# EasyEDA Pro project ESP32C3电流表.epro

# Schematic Schematic1
Create Date: 2024-03-27; Page Name: P1; Project Name: ESP32C3电流表; Schematic Name: Schematic1; Update Date: 2024-03-28; Company: 嘉立创EDA; Page Size: A4; Version: V1.0
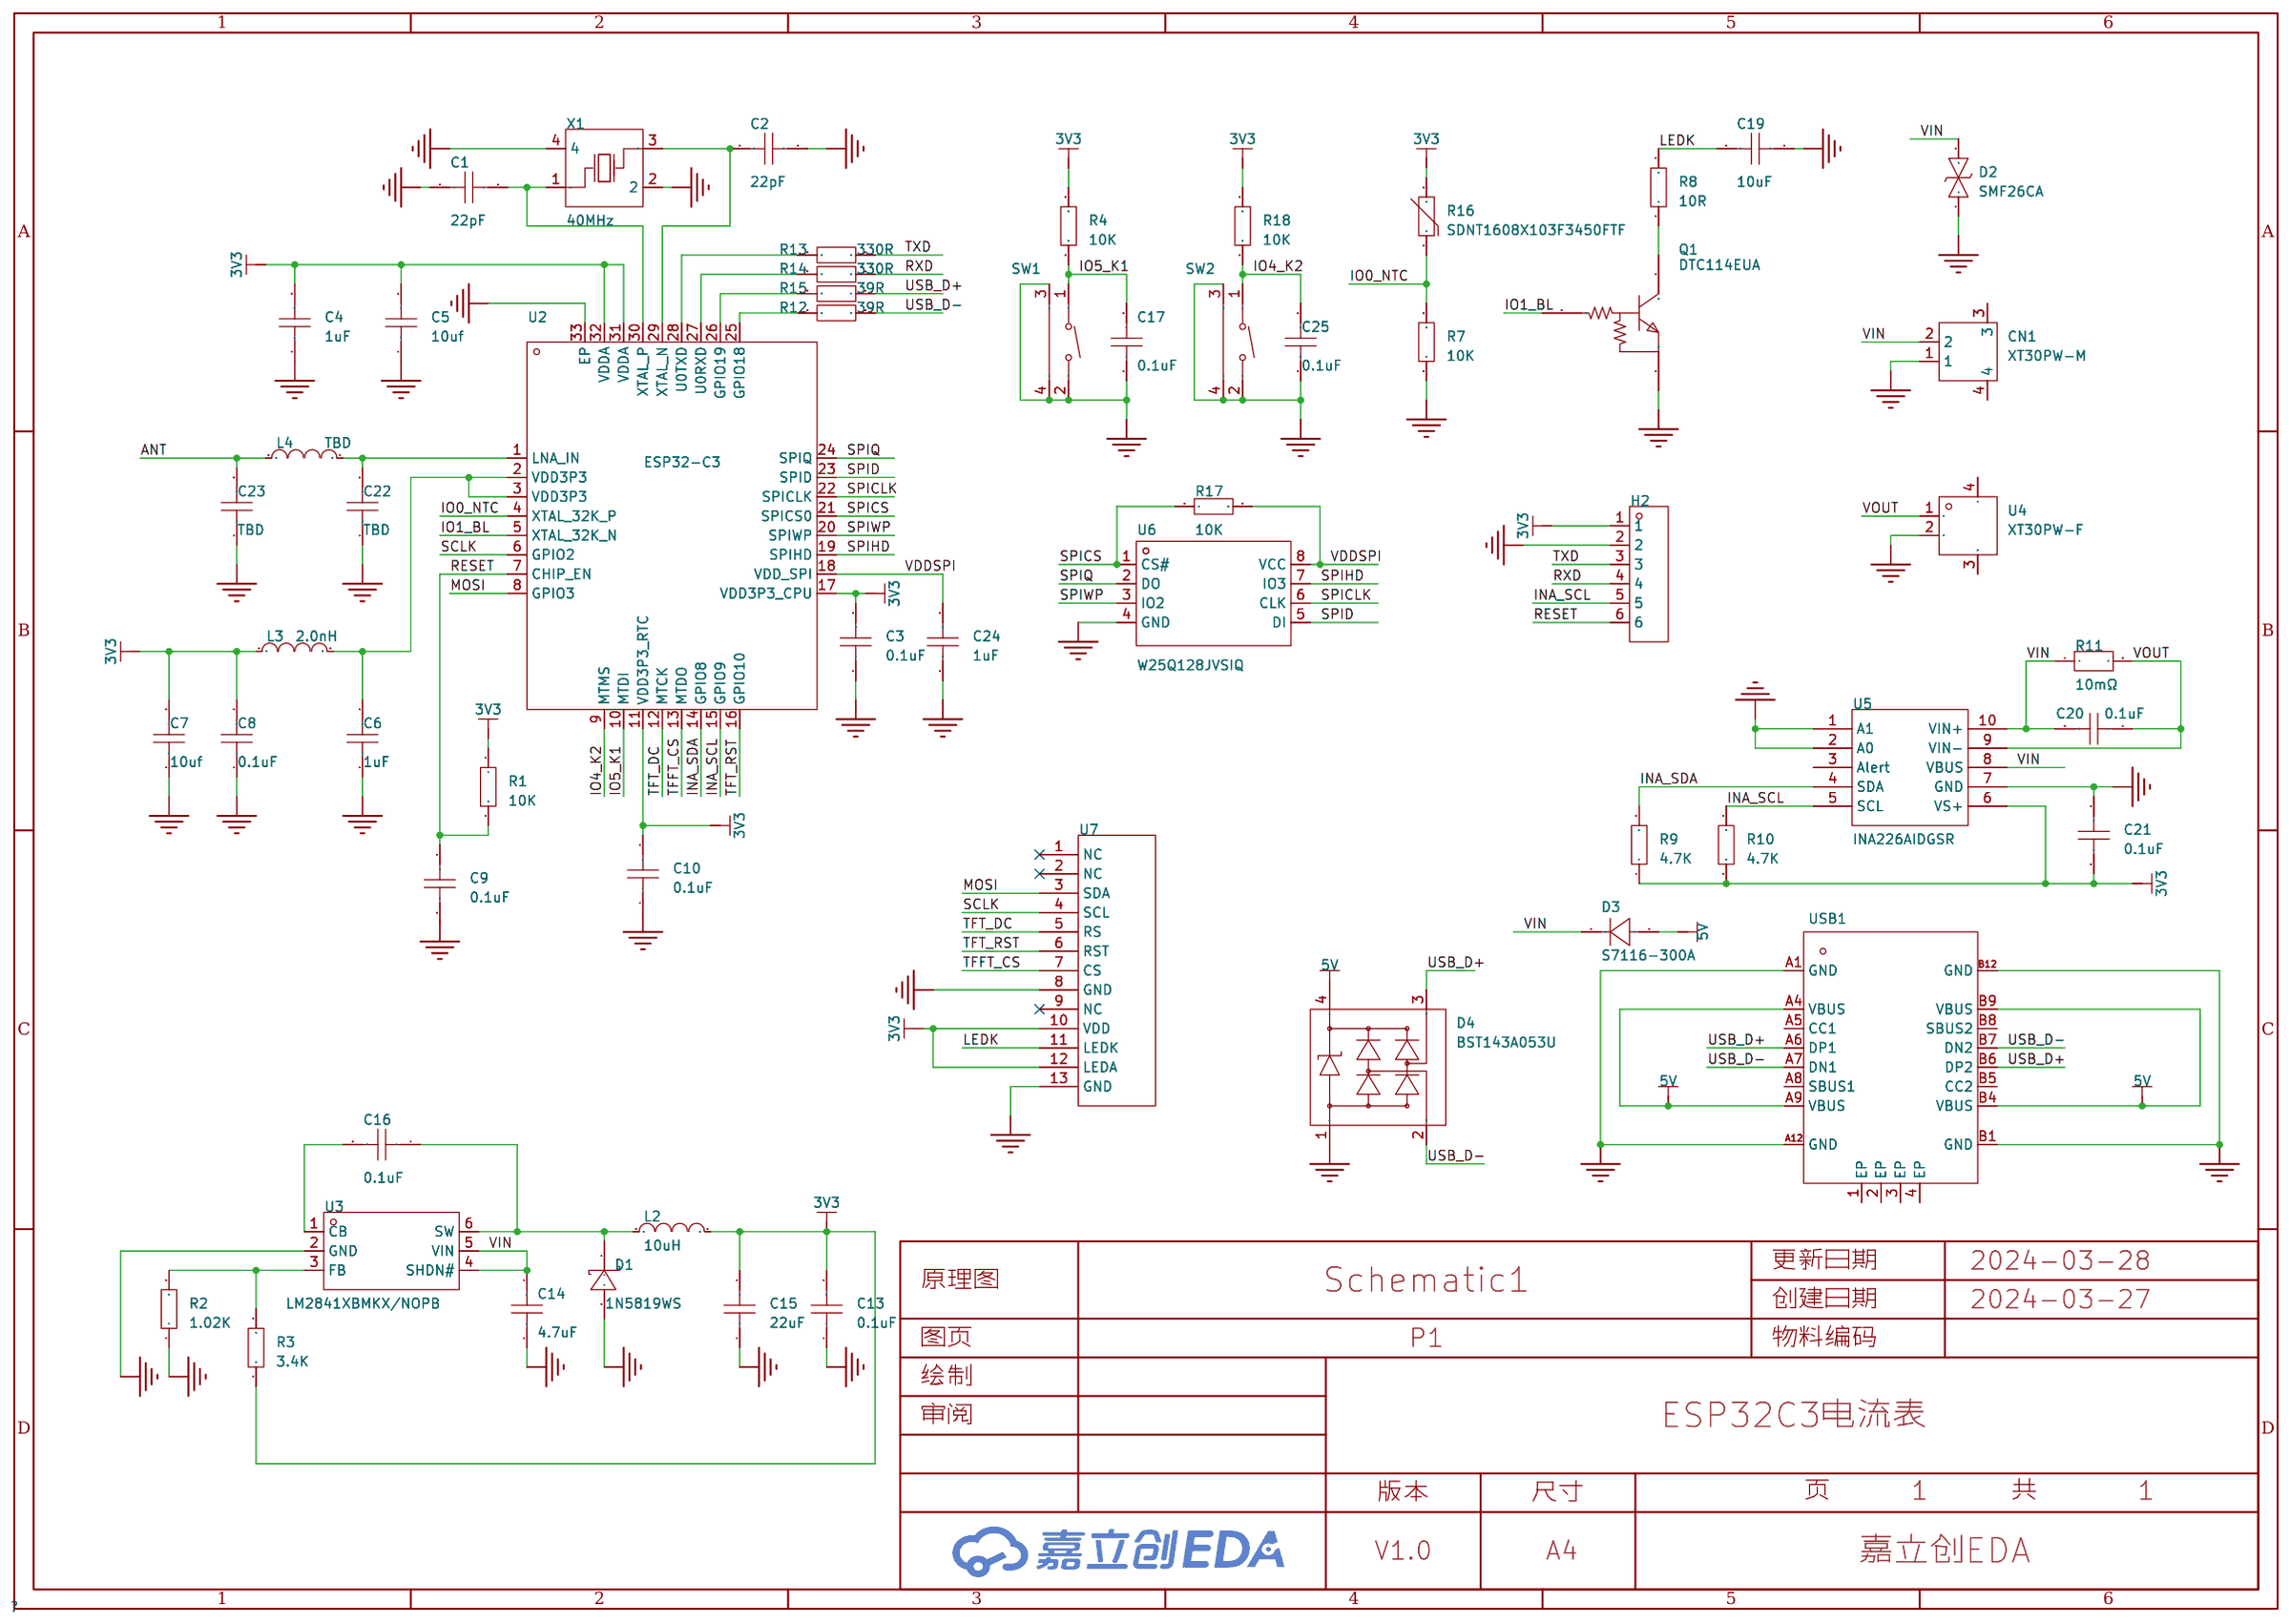
[diagram p0: schematic sheet]

## Parts
C1  22pF  [C0603]
C2  22pF  [C0603]
C3  0.1uF  [C0603]
C4  1uF  [C0603]
C5  10uf  [C0603]
C6  1uF  [C0603]
C7  10uf  [C0603]
C8  0.1uF  [C0603]
C9  0.1uF  [C0603]
C10  0.1uF  [C0603]
C13  0.1uF  [C0603]
C14  4.7uF  [C0805]
C15  22uF  [C0805]
C16  0.1uF  [C0603]
C17  0.1uF  [C0603]
C19  10uF  [C0603]
C20  0.1uF  [C0603]
C21  0.1uF  [C0603]
C22  TBD  [C0603]
C23  TBD  [C0603]
C24  1uF  [C0603]
C25  0.1uF  [C0603]
CN1  XT30PW-M  [CONN-TH_XT30PW-M]
D1  1N5819WS  [SOD-323_L1.8-W1.3-LS2.5-RD]
D2  SMF26CA  [SOD-123_L2.8-W1.8-LS3.7-BI]
D3  S7116-300A  [SOD-323_L1.7-W1.3-LS2.5-RD]
D4  BST143A053U  [SOT-143_L2.9-W1.3-P1.92-LS2.3-BR]
H2  -  [HDR-TH_6P-P2.54-V-F]
L2  10uH  [IND-SMD_L2.5-W2.0_FHD252012S-6R8MT]
L3  2.0nH  [L0603]
L4  TBD  [L0603]
Q1  DTC114EUA  [SOT-323-3_L2.0-W1.3-P1.30-LS2.1-BR]
R1  10K  [R0603]
R2  1.02K  [R0603]
R3  3.4K  [R0603]
R4  10K  [R0603]
R7  10K  [R0603]
R8  10R  [R0603]
R9  4.7K  [R0603]
R10  4.7K  [R0603]
R11  10mΩ  [R2512]
R12  39R  [R0603]
R13  330R  [R0603]
R14  330R  [R0603]
R15  39R  [R0603]
R16  SDNT1608X103F3450FTF  [R0603]
R17  10K  [R0603]
R18  10K  [R0603]
SW1  TS-1010-C-A  [KEY-SMD_TX-1010-X-X]
SW2  TS-1010-C-A  [KEY-SMD_TX-1010-X-X]
U2  ESP32-C3  [QFN-32_L5.0-W5.0-P0.50-TL-EP3.7]
U3  LM2841XBMKX/NOPB  [SOT-23-6_L2.9-W1.6-P0.95-LS2.8-BR]
U4  XT30PW-F  [CONN-TH_XT30PW-F-1]
U5  INA226AIDGSR  [MSOP-10_L3.0-W3.0-P0.50-LS5.0-BL]
U6  W25Q128JVSIQ  [SOIC-8_L5.3-W5.3-P1.27-LS8.0-BL]
U7  -  [ST7789]
USB1  -  [USB_TYPE-C-16P]
X1  40MHz  [OSC-SMD_4P-L3.2-W2.5-BL]

## Library data of the parts
C1-C10 C13 C16 C17 C19-C25 = CAP_0603: Supplier Footprint: 0603
C14 C15 = CAP_0805: Supplier Footprint: 0805
CN1 = XT30PW-M: 类别:-;类型1:-;; LCSC Part Name: AMASS(艾迈斯)航模插头 卧式弯脚 XT30PW-M公头; Supplier Part: C431092; Manufacturer: AMASS(艾迈斯); JLCPCB Part Class: 扩展库; Datasheet: https://atta.szlcsc.com/upload/public/pdf/source/20220222/6A9F22F7850E25B33E1BE430ADF8560B.pdf; Supplier: LCSC; Brand: 艾迈斯; Type: 航模插头; RatedVoltage: DC 500V; InterfaceType: 公头; RatedCurrent: 15A; RecommendedWireGauge: 16/18/20AWG; contact resistance: 1.2mΩ; specifications: 2pin
D1 = 1N5819WS_C191023: 正向压降(Vf):600mV@1A;直流反向耐压(Vr):40V;平均整流电流(Io):1A;; LCSC Part Name: 电压:40V 电流:1A; Supplier Part: C191023; Manufacturer: Hottech(合科泰); Supplier Footprint: SOD-323; JLCPCB Part Class: 基础库; Datasheet: https://atta.szlcsc.com/upload/public/pdf/source/20220428/3CB86FD8D28D653594B4E35F9D5AEFD9.pdf; Supplier: LCSC; Forward Voltage (Vf@If): 600mV@1A; Reverse Voltage (Vr): 40V; Average Rectified Current (Io): 1A
D2 = SMF26CA_C435495: 反向截止电压(Vrwm):26V;最大钳位电压:42.1V;峰值脉冲电流(Ipp)@10/1000us:4.8A;击穿电压:28.9V;; Supplier Part: C435495; Manufacturer: AnBon(安邦); Supplier Footprint: SOD-123; JLCPCB Part Class: 扩展库; Datasheet: https://atta.szlcsc.com/upload/public/pdf/source/20191009/C435508_DB7B75E48DB0811659B52C5D7F67F4F0.pdf; Supplier: LCSC; Reverse Stand-Off Voltage (Vrwm): 26V; Maximum Clamping Voltage: 42.1V; Peak Pulse Current (Ipp)@10/1000us: 4.8A; Breakdown Voltage: 28.9V; Type: TVS
D3 = S7116-300A: 二极管配置:独立式;正向压降(Vf):500mV@1A;直流反向耐压(Vr):45V;平均整流电流(Io):1A;; Supplier Part: C5174649; Manufacturer: MSKSEMI(美森科); Supplier Footprint: SOD-323; JLCPCB Part Class: 扩展库; Datasheet: https://atta.szlcsc.com/upload/public/pdf/source/20220916/6E626650AF012B3914EB9177AF15DFBA.pdf; Supplier: LCSC; Diode Configuration: 独立式; Forward Voltage (Vf@If): 500mV@1A; Reverse Voltage (Vr): 45V; Average Rectified Current (Io): 1A
D4 = BST143A053U: 反向截止电压(Vrwm):5V;最大钳位电压:25V;峰值脉冲电流(Ipp)@10/1000us:12A@8/20us;; Supplier Part: C151979; Manufacturer: BORN(伯恩半导体); Supplier Footprint: SOT-143; JLCPCB Part Class: 扩展库; Datasheet: https://atta.szlcsc.com/upload/public/pdf/source/20180207/C151979_15179948915521359098.pdf; Supplier: LCSC; Reverse Stand-Off Voltage (Vrwm): 5V; Maximum Clamping Voltage: 25V; Peak Pulse Current (Ipp)@10/1000us: 12A@8/20us; Type: TVS
H2 = HDR-F_2.54_1x6P: Supplier Part: C40877; Supplier Footprint: 插件
L2 = FHD252012S-100MT: 电感值:10uH;精度:±20%;额定电流:1A;饱和电流(Isat):1.35A;; LCSC Part Name: 10uH ±20% 1.35A; Supplier Part: C602018; Manufacturer: cjiang(长江微电); Supplier Footprint: 1008; JLCPCB Part Class: 扩展库; Datasheet: https://atta.szlcsc.com/upload/public/pdf/source/20200609/C601990_BCEA243EC4DA0A9A288AA78A6DFB48A5.pdf; Supplier: LCSC; Tolerance: ±20%; Rated Current: 1A; Saturation Current (Isat): 1.35A; DC Resistance (DCR): 435mΩ
L3 L4 = L_0603
Q1 = DTC114EUA_C55054: 晶体管类型:1个NPN-预偏置;集射极击穿电压(Vceo):50V;集电极电流(Ic):50mA;功率(Pd):200mW;; LCSC Part Name: 电流:50mA 耐压:50V; Supplier Part: C55054; Manufacturer: CJ(江苏长电/长晶); Supplier Footprint: SOT-323-3; JLCPCB Part Class: 扩展库; Datasheet: https://atta.szlcsc.com/upload/public/pdf/source/20150811/1457707342575.pdf; Supplier: LCSC; Transistor Type: 1个NPN-预偏置; Collector-Emitter Breakdown Voltage (Vceo): 50V; Collector Current (Ic): 50mA; Power Dissipation (Pd): 200mW
R1-R4 R7-R10 R12-R15 R17 R18 = Res_0603: Supplier Footprint: 0603
R11 = PA2512FKE7T0R01E: 电阻类型:采样电阻;阻值:10mΩ;精度:±1%;额定压降:-;功率:3W;温度系数:±50ppm/℃;安装方式:-;; LCSC Part Name: 10mΩ ±1% 3W; Supplier Part: C375691; Manufacturer: YAGEO(国巨); Supplier Footprint: 2512; JLCPCB Part Class: 扩展库; Datasheet: https://atta.szlcsc.com/upload/public/pdf/source/20190227/C375693_219964CC8B3EBD36DBDF701587FA5938.pdf; Supplier: LCSC; Type: 采样电阻; Tolerance: ±1%; Power(Watts): 3W; Temperature Coefficient: ±50ppm/℃
R16 = SDNT1608X103F3450FTF: 阻值(25℃):10kΩ;B值(25℃/50℃):3450K;电阻精度:±1%;功率:100mW;B值精度:±1%;最大稳态电流(25℃):310uA;; LCSC Part Name: 10kΩ 电阻精度:±1% 3450K; Supplier Part: C95953; Manufacturer: Sunlord(顺络); Supplier Footprint: 0603; JLCPCB Part Class: 扩展库; Datasheet: https://atta.szlcsc.com/upload/public/pdf/source/20210916/BF106A3565EDFEB141CB3E0EA3A661F8.pdf; Supplier: LCSC; Resistance @ 25℃: 10kΩ; B Constant (25℃/50℃): 3450K; Resistance Tolerance: ±1%; Power: 100mW; B Constant Tolerance: ±1%; Steady State Current (Max): 310uA; Operating Temperature: -55℃~+125℃
SW1 SW2 = TS-1010-C-A: 电路结构:单刀单掷;按钮形状:矩形按钮;作用力:260gf;安装方式:卧贴;开关长度:2.3mm;开关宽度:4.7mm;开关高度:3.5mm;带支架:不带;触点电流:50mA;额定电压(AC):-;额定电压(DC):12V;额定功率:-;绝缘电阻:-;带灯:无;机械寿命:10万次;; LCSC Part Name: 2.3*4.7*3.5mm 卧贴 轻触开关; Supplier Part: C692458; Manufacturer: XKB Connectivity(中国星坤); Supplier Footprint: SMD; JLCPCB Part Class: 扩展库; Datasheet: https://atta.szlcsc.com/upload/public/pdf/source/20211011/09621D275CE0F472C941775DFBBCCC96.pdf; Supplier: LCSC; Circuit: 单刀单掷; Actuator Style: 矩形按钮; Operating Force: 260gf; Mounting Style: 卧贴; Switch Length: 2.3mm; Switch Width: 4.7mm; Switch Height: 3.5mm; Strike Gundam: 不带; Contact Current: 50mA; Voltage Rating (DC): 12V; Actuator/Cap Color: 黑色; With Lamp: 无; Mechanical Life: 10万次; Operating Temperature: -30℃~+85℃
U2 = ESP32-C3: CPU内核:RISC-V;RAM总容量:400KB;GPIO端口数量:22;工作电压范围:3V~3.6V;CPU最大主频:160MHz;程序存储器类型:-;; Supplier Part: C2838500; Manufacturer: ESPRESSIF(乐鑫); Supplier Footprint: QFN-32-EP(5x5); JLCPCB Part Class: 扩展库; Datasheet: https://atta.szlcsc.com/upload/public/pdf/source/20231220/86199E4714F7A99F6AA9401EA48CDBDA.pdf; Supplier: LCSC; CPU Core: RISC-V; RAM Size: 400KB; GPIO Ports Number: 22; Operating Voltage Range: 3V~3.6V; CPU Maximum Speed: 160MHz; Operating Temperature Range: -40℃~+105℃; ADC (Bit): 12bit; UART/USART: 2; I2C: 1; I2S: 1; SPI: 3; Peripheral/Function: 蓝牙协议栈；片载温度传感器；真随机数发生器；DMA；看门狗；WIFI协议栈；硬件密码算法引擎；54位Timer；PWM；RTC实时时钟; communication protocol: 蓝牙协议；WIFI协议; Watchdog: 有; Real-Time Clock: 有; Direct Memory Access: 有
U3 = LM2841XBMKX/NOPB: 功能类型:降压型;输入电压:-;输出电流(最大值):-;; Supplier Part: C19347; Manufacturer: TI(德州仪器); Supplier Footprint: SOT-23-6; JLCPCB Part Class: 扩展库; Datasheet: http://www.ti.com/; Supplier: LCSC; Function: 降压型; Switch tube (built-in/external): 内置
U4 = XT30PW-F: 类别:-;类型1:-;; LCSC Part Name: AMASS(艾迈斯)电源连接器 母头 XT30PW-F; Supplier Part: C2913282; Manufacturer: AMASS(艾迈斯); JLCPCB Part Class: 扩展库; Datasheet: https://atta.szlcsc.com/upload/public/pdf/source/20231218/06CFCF98887A9A87638B0856A725C8FD.pdf; Supplier: LCSC; Brand: 艾迈斯; Type: 航模插头; InterfaceType: 母头
U5 = INA226AIDGSR: INA226 支持报警功能的 36V、双向、超高精度、低侧/高侧、I2C 输出电流/功率监控器; Supplier Part: C49851; Manufacturer: TI(德州仪器); Supplier Footprint: MSOP-10; JLCPCB Part Class: 扩展库; Datasheet: https://www.ti.com/cn/lit/gpn/ina226; Supplier: LCSC; Supply Voltage: 0V~36V; Operating Temperature: -40℃~+125℃
U6 = W25Q128JVSIQ: 接口类型:-;存储容量:128Mbit;时钟频率(fc):-;; LCSC Part Name: W25Q128JVSIQ 编带; Supplier Part: C97521; Manufacturer: WINBOND(华邦); Supplier Footprint: SOIC-8-208mil; JLCPCB Part Class: 基础库; Datasheet: https://atta.szlcsc.com/upload/public/pdf/source/20170316/1489627409956.pdf; Supplier: LCSC; Memory Size: 128Mbit
U7 = ST7789
USB1 = USB_TYPE-C-16P: Supplier Footprint: SMD
X1 = 1ZNY12000AB0C: 晶振类型:-;频率:-;外接负载电容:-;; LCSC Part Name: 12MHz 12pF; Supplier Part: C253730; Manufacturer: KDS(大真空); Supplier Footprint: SMD3225-4P; JLCPCB Part Class: 扩展库; Datasheet: https://atta.szlcsc.com/upload/public/pdf/source/20240109/50CD19B77F5B596E0573B9A206470299.pdf; Supplier: LCSC

## Nets
3V3: C3.2 C4.2 C5.2 C7.2 C8.2 C10.2 C13.2 C15.2 C21.2 H2.1 L2.2 L3.1 R1.1 R3.1 R4.2 R9.1 R10.1 R16.2 R18.2 U2.11(VDD3P3_RTC) U2.17(VDD3P3_CPU) U2.31(VDDA) U2.32(VDDA) U5.6(VS+) U7.10(VDD) U7.12(LEDA)
5V: D3.2(A) D4.4 USB1.A4(VBUS) USB1.A9(VBUS) USB1.B4(VBUS) USB1.B9(VBUS)
GND: C1.1 C2.2 C3.1 C4.1 C5.1 C6.1 C7.1 C8.1 C9.2 C10.1 C13.1 C14.1 C15.1 C17.1 C19.1 C21.1 C22.1 C23.1 C24.1 C25.1 CN1.1 D1.2(A) D2.1 D4.1 H2.2 Q1.2(GND) R2.1 R7.1 SW1.2 SW1.3 SW1.4 SW2.2 SW2.3 SW2.4 U2.33(EP) U3.2(GND) U4.2 U5.1(A1) U5.2(A0) U5.7(GND) U6.4(GND) U7.8(GND) U7.13(GND) USB1.A1(GND) USB1.A12(GND) USB1.B1(GND) USB1.B12(GND) X1.2 X1.4
VDDSPI: C24.2 R17.2 U2.18(VDD_SPI) U6.8(VCC)
VIN: C14.2 C20.2 CN1.2 D2.2 D3.1(K) R11.1 U3.4(SHDN#) U3.5(VIN) U5.8(VBUS) U5.10(VIN+)
ANT: C23.2 L4.1
INA_SCL: H2.5 R10.2 U2.15(GPIO9) U5.5(SCL)
INA_SDA: R9.2 U2.14(GPIO8) U5.4(SDA)
IO0_NTC: R7.2 R16.1 U2.4(XTAL_32K_P)
IO1_BL: Q1.1(IN) U2.5(XTAL_32K_N)
IO4_K2: C25.2 R18.1 SW2.1 U2.9(MTMS)
IO5_K1: C17.2 R4.1 SW1.1 U2.10(MTDI)
LEDK: C19.2 R8.2 U7.11(LEDK)
MOSI: U2.8(GPIO3) U7.3(SDA)
RESET: C9.1 H2.6 R1.2 U2.7(CHIP_EN)
RXD: H2.4 R14.1
SCLK: U2.6(GPIO2) U7.4(SCL)
SPICLK: U2.22(SPICLK) U6.6(CLK)
SPICS: R17.1 U2.21(SPICS0) U6.1(CS#)
SPID: U2.23(SPID) U6.5(DI)
SPIHD: U2.19(SPIHD) U6.7(IO3)
SPIQ: U2.24(SPIQ) U6.2(DO)
SPIWP: U2.20(SPIWP) U6.3(IO2)
TFFT_CS: U2.13(MTDO) U7.7(CS)
TFT_DC: U2.12(MTCK) U7.5(RS)
TFT_RST: U2.16(GPIO10) U7.6(RST)
TXD: H2.3 R13.1
USB_D+: D4.3 R15.1 USB1.A6(DP1) USB1.B6(DP2)
USB_D-: D4.2 R12.1 USB1.A7(DN1) USB1.B7(DN2)
VOUT: C20.1 R11.2 U4.1 U5.9(VIN-)
$1N2271: R12.2 U2.25(GPIO18)
$1N2275: R15.2 U2.26(GPIO19)
$1N2279: R14.2 U2.27(U0RXD)
$1N2283: R13.2 U2.28(U0TXD)
$1N2291: C2.1 U2.29(XTAL_N) X1.3(OSC2)
$1N2297: C1.2 U2.30(XTAL_P) X1.1(OSC1)
$1N3406: C16.2 U3.1(CB)
$1N3430: R2.2 R3.2 U3.3(FB)
$1N3499: C16.1 D1.1(K) L2.1 U3.6(SW)
$1N4049: Q1.3(OUT) R8.1
$1N6152: C22.2 L4.2 U2.1(LNA_IN)
$1N9079: C6.2 L3.2 U2.2(VDD3P3) U2.3(VDD3P3)

Not connected (* = marked no-connect by the designer): CN1 3 4; U4 3 4; U5 3(Alert); U7 1(NC)* 2(NC)* 9(NC)*; USB1 1(EP) 2(EP) 3(EP) 4(EP) A5(CC1) A8(SBUS1) B5(CC2) B8(SBUS2)

# Board PCB1
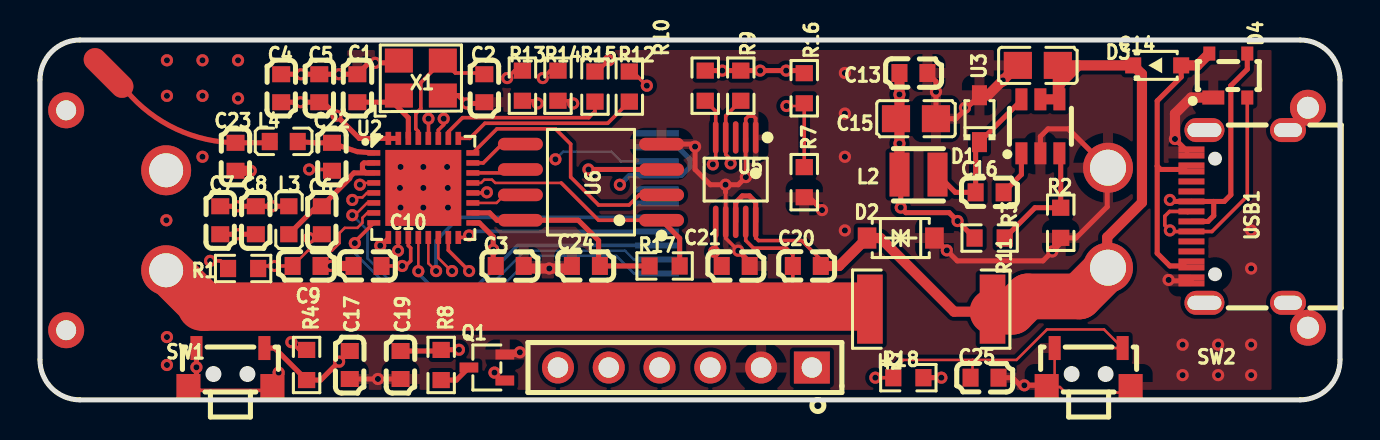
[diagram p1: board, top side]
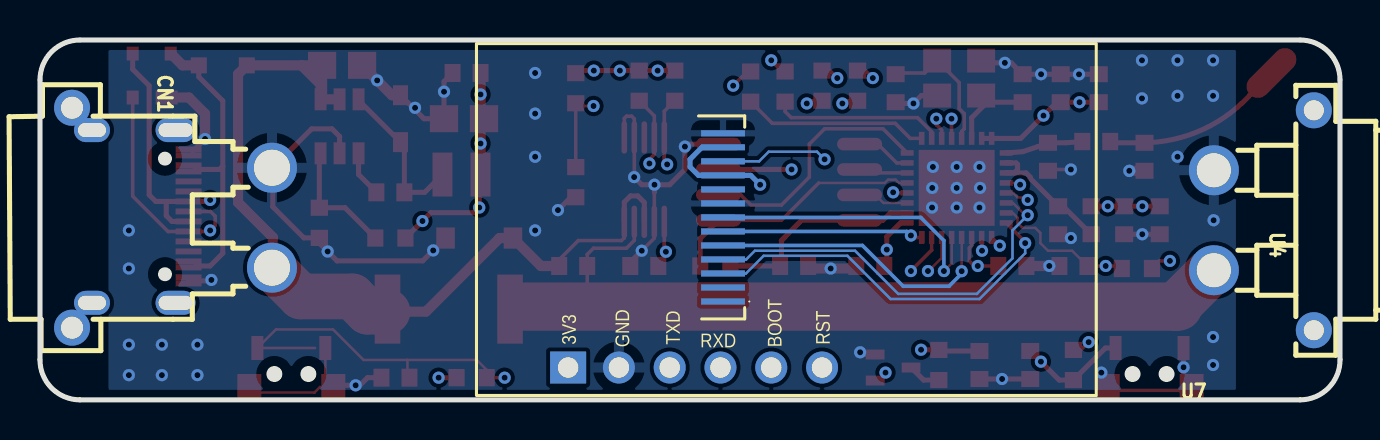
[diagram p2: board, bottom side, seen from below]

Outline 65.02 x 18 mm; copper layers: Top Layer, GND, VCC, Bottom Layer. Coordinates in mm from the lower left corner of the outline.
Outline path: 0,16 0,2 arc(0.59,0.59) 2,0 63.02,0 arc(64.44,0.59) 65.02,2 65.02,16 arc(64.44,17.41) 63.02,18 2,18 arc(0.59,17.41) 0,16
Stack: Top Layer 0.035mm 外层铜厚1oz / Dielectric1 0.2104mm 7628 RC49% 8.6mil / GND 0.0152mm 内层铜厚 / Dielectric2 1.065mm 1.1mm H/HOZ 含铜 / VCC 0.0152mm 内层铜厚 / Dielectric3 0.2104mm 7628 RC49% 8.6mil / Bottom Layer 0.035mm 外层铜厚1oz

## Design rules (mm)
template: 自定义配置
spacing copperThickness1oz (default): track to track 0.102, other pairs 0.152 to 0.3
spacing copperThickness2oz: track to track 0.203, other pairs 0.152 to 0.3
track width copperThickness1oz (default): min 0.127, default 0.254, max 2.54
track width copperThickness2oz: min 0.203, default 0.254, max 2.54
differential pair differentialPair (default): width min 0.127, default 0.254, max 2.54; gap min 0.152, default 0.152
via viaSize (default): diameter min 0.5, default 0.61, max 10; hole min 0.3, default 0.305, max 6.299

## Placement (name value [footprint] x y rotation side)
C1  22pF  [C0603]  15.88 15.59 270 top
C2  22pF  [C0603]  22.22 15.59 270 top
C3  0.1uF  [C0603]  23.5 6.7 180 top
C4  1uF  [C0603]  12.06 15.59 270 top
C5  10uf  [C0603]  13.97 15.59 270 top
C6  1uF  [C0603]  14.1 8.98 90 top
C7  10uf  [C0603]  9.02 8.98 90 top
C8  0.1uF  [C0603]  10.79 8.98 90 top
C9  0.1uF  [C0603]  13.34 6.7 0 top
C10  0.1uF  [C0603]  16.38 6.7 0 top
C13  0.1uF  [C0603]  43.69 16.35 180 top
C14  4.7uF  [C0805]  49.91 16.73 0 top
C15  22uF  [C0805]  43.81 14.06 180 top
C16  0.1uF  [C0603]  47.5 10.38 0 top
C17  0.1uF  [C0603]  15.49 1.74 90 top
C19  10uF  [C0603]  18.03 1.74 90 top
C20  0.1uF  [C0603]  38.35 6.7 0 top
C21  0.1uF  [C0603]  34.8 6.7 180 top
C22  TBD  [C0603]  14.6 12.16 90 top
C23  TBD  [C0603]  9.78 12.16 90 top
C24  1uF  [C0603]  27.31 6.7 0 top
C25  0.1uF  [C0603]  47.24 1.11 180 top
CN1  XT30PW-M  [CONN-TH_XT30PW-M]  58.42 9.11 270 bottom
D1  1N5819WS  [SOD-323_L1.8-W1.3-LS2.5-RD]  46.99 14.06 90 top
D2  SMF26CA  [SOD-123_L2.8-W1.8-LS3.7-BI]  43.05 8.09 0 top
D3  S7116-300A  [SOD-323_L1.7-W1.3-LS2.5-RD]  55.88 16.73 0 top
D4  BST143A053U  [SOT-143_L2.9-W1.3-P1.92-LS2.3-BR]  59.44 16.22 270 top
H2  -  [HDR-TH_6P-P2.54-V-F]  32.26 1.62 180 top
L2  10uH  [IND-SMD_L2.5-W2.0_FHD252012S-6R8MT]  43.94 11.27 180 top
L3  2.0nH  [L0603]  12.45 8.98 270 top
L4  TBD  [L0603]  12.19 12.92 0 top
NOREF  -  [Pad_e656]  3.43 16.35 135 top
Q1  DTC114EUA  [SOT-323-3_L2.0-W1.3-P1.30-LS2.1-BR]  22.35 1.62 0 top
R1  10K  [R0603]  10.16 6.57 0 top
R2  1.02K  [R0603]  51.05 8.86 90 top
R3  3.4K  [R0603]  47.5 8.09 0 top
R4  10K  [R0603]  13.34 1.74 90 top
R7  10K  [R0603]  38.23 10.89 90 top
R8  10R  [R0603]  20.07 1.74 90 top
R9  4.7K  [R0603]  35.05 15.71 270 top
R10  4.7K  [R0603]  33.27 15.71 270 top
R11  10mΩ  [R2512]  44.58 4.54 180 top
R12  39R  [R0603]  29.48 15.67 270 top
R13  330R  [R0603]  24.13 15.71 90 top
R14  330R  [R0603]  25.91 15.71 90 top
R15  39R  [R0603]  27.76 15.67 270 top
R16  SDNT1608X103F3450FTF  [R0603]  38.23 15.59 90 top
R17  10K  [R0603]  31.24 6.7 180 top
R18  10K  [R0603]  43.43 1.11 0 top
SW1  TS-1010-C-A  [KEY-SMD_TX-1010-X-X]  9.53 1.62 180 top
SW2  TS-1010-C-A  [KEY-SMD_TX-1010-X-X]  52.45 1.62 180 top
U2  ESP32-C3  [QFN-32_L5.0-W5.0-P0.50-TL-EP3.7]  19.17 10.6 0 top
U3  LM2841XBMKX/NOPB  [SOT-23-6_L2.9-W1.6-P0.95-LS2.8-BR]  50.04 13.68 270 top
U4  XT30PW-F  [CONN-TH_XT30PW-F-1]  3.81 8.98 90 bottom
U5  INA226AIDGSR  [MSOP-10_L3.0-W3.0-P0.50-LS5.0-BL]  34.8 11.02 180 top
U6  W25Q128JVSIQ  [SOIC-8_L5.3-W5.3-P1.27-LS8.0-BL]  27.56 10.89 90 top
U7  -  [ST7789]  30.86 4.92 0 bottom
USB1  HC-TYPE-C-16P-01B  [USB_TYPE-C-16P]  60.01 9.05 90 top
X1  40MHz  [OSC-SMD_4P-L3.2-W2.5-BL]  19.05 16.09 0 top

## Footprints (pads in the part's own frame, mm; a bottom-side part is the same pattern mirrored in y, then rotated)
C0603
  rect 0.8x0.9 smd: 1(-0.7,0) 2(0.7,0)
C0805
  rect 1.41x1.35 smd: 1(-1,0) 2(1,0)
CONN-TH_XT30PW-F-1
  round 2.5 hole 1.7: 1(-2.5,2.5) 2(2.5,2.5)
  round 1.8 hole 1: 3(5.5,-2.5) 4(-5.5,-2.5)
CONN-TH_XT30PW-M
  round 2.5 hole 1.8: 1(-2.5,5) 2(2.5,5)
  round 1.8 hole 1.1: 3(5.5,-5) 4(-5.5,-5)
HDR-TH_6P-P2.54-V-F
  rect 1.8x1.6 hole 1.02: 1(-6.35,0)
  round 1.6 hole 1.02: 2(-3.81,0) 3(-1.27,0) 4(1.27,0) 5(3.81,0) 6(6.35,0)
IND-SMD_L2.5-W2.0_FHD252012S-6R8MT
  rect 1x2.2 smd: 1(-0.951,0) 2(0.951,0)
KEY-SMD_TX-1010-X-X
  rect 0.6x1.2 smd: 1(-1.7,-0.975) 2(1.7,-0.975)
  rect 1.2x1.3 smd: 3(-2.1,0.975) 4(2.1,0.975)
L0603
  rect 0.8x0.864 smd: 1(-0.7,0) 2(0.7,0)
MSOP-10_L3.0-W3.0-P0.50-LS5.0-BL
  oval 0.28x1.62 smd: 1(-1,-2.11) 2(-0.5,-2.11) 3(0,-2.11) 4(0.5,-2.11) 5(1,-2.11) 6(1,2.11) 7(0.5,2.11) 8(0,2.11) 9(-0.5,2.11) 10(-1,2.11)
OSC-SMD_4P-L3.2-W2.5-BL
  rect 1.4x1.2 smd: 1(-1.1,-0.875) 2(1.1,-0.875) 3(1.1,0.875) 4(-1.1,0.875)
Pad_e656
  oval 3.048x1.143 smd: 1(0,0)
QFN-32_L5.0-W5.0-P0.50-TL-EP3.7
  rect 0.65x0.28 smd: 1(-2.478,1.75) 2(-2.478,1.25) 3(-2.478,0.75) 4(-2.478,0.25) 5(-2.478,-0.25) 6(-2.478,-0.75) 7(-2.478,-1.25) 8(-2.478,-1.75) 17(2.478,-1.75) 18(2.478,-1.25) 19(2.478,-0.75) 20(2.478,-0.25) 21(2.478,0.25) 22(2.478,0.75) 23(2.478,1.25) 24(2.478,1.75)
  rect 0.28x0.65 smd: 9(-1.75,-2.478) 10(-1.25,-2.478) 11(-0.75,-2.478) 12(-0.25,-2.478) 13(0.25,-2.478) 14(0.75,-2.478) 15(1.25,-2.478) 16(1.75,-2.478) 25(1.75,2.478) 26(1.25,2.478) 27(0.75,2.478) 28(0.25,2.478) 29(-0.25,2.478) 30(-0.75,2.478) 31(-1.25,2.478) 32(-1.75,2.478)
  rect 3.8x3.8 smd: 33(0,0)
R0603
  rect 0.806x0.864 smd: 1(-0.753,0) 2(0.753,0)
R2512
  rect 1.282x3.456 smd: 1(-3.067,0) 2(3.067,0)
SOD-123_L2.8-W1.8-LS3.7-BI
  rect 0.93x1.06 smd: 1(1.685,0) 2(-1.685,0)
SOD-323_L1.7-W1.3-LS2.5-RD
  rect 0.8x0.8 smd: 1(-1.2,0) 2(1.2,0)
SOD-323_L1.8-W1.3-LS2.5-RD
  rect 1x0.75 smd: 1(-1.173,0) 2(1.173,0)
SOIC-8_L5.3-W5.3-P1.27-LS8.0-BL
  oval 0.63x2.25 smd: 1(-1.905,-3.53) 2(-0.635,-3.53) 3(0.635,-3.53) 4(1.905,-3.53) 5(1.905,3.53) 6(0.635,3.53) 7(-0.635,3.53) 8(-1.905,3.53)
SOT-23-6_L2.9-W1.6-P0.95-LS2.8-BR
  rect 1.1x0.6 smd: 1(1.35,-0.95) 2(1.35,0) 3(1.35,0.95) 4(-1.35,0.95) 5(-1.35,0) 6(-1.35,-0.95)
SOT-143_L2.9-W1.3-P1.92-LS2.3-BR
  rect 0.7x1.1 smd: 1(1.1,-0.75)
  rect 0.7x0.6 smd: 2(1.1,0.95) 3(-1.1,0.95) 4(-1.1,-0.95)
SOT-323-3_L2.0-W1.3-P1.30-LS2.1-BR
  rect 0.936x0.5 smd: 1(0.898,-0.65) 2(0.898,0.65) 3(-0.898,0)
ST7789
  rect 2.193x0.307 smd: 1(0,0) 2(0,-0.701) 3(0,-1.402) 4(0,-2.103) 5(0,-2.804) 6(0,-3.505) 7(0,-4.206) 8(0,-4.907) 9(0,-5.609) 10(0,-6.309) 11(0,-7.011) 12(0,-7.712) 13(0,-8.412)
USB_TYPE-C-16P
  oval 1.2x2 hole 0.7x1.7: 1(-4.193,1.765) 2(4.447,1.765)
  oval 1.2x1.8 hole 0.7x1.4: 3(-4.193,-2.415) 4(4.447,-2.415)
  rect 0.3x1.3 smd: A1(-3.223,2.415) A4(-2.423,2.415) A5(-1.123,2.415) A6(-0.123,2.415) A7(0.377,2.415) A8(1.377,2.415) A9(2.677,2.415) A12(3.477,2.415) B1(3.177,2.415) B4(2.377,2.415) B5(1.877,2.415) B6(0.877,2.415) B7(-0.623,2.415) B8(-1.623,2.415) B9(-2.123,2.415) B12(-2.923,2.415)

## Nets
As in the schematic, except:
ANT: C23.2 L4.1 NOREF.1

Pads without a net: CN1 3 4; U4 3 4; U5 3; U7 1 2 9; USB1 1 2 3 4 A5 A8 B5 B8

## Via types
v1: diameter 0.61, hole 0.305, Top Layer to Bottom Layer, 108 vias

## Routing (per net, layer and track width the routed paths; a pad name or vN(x,y) marks a point on that pad's centre or on a via; arc(x,y) is an arc through that point)
3V3: length 42.9
  Top Layer w0.178: R4.2 12.96,2.5 v1(12.57,2.89) ; C10.2 18.29,6.7 18.54,6.95 18.54,7.59 18.42,7.71 U2.11 ; U5.6 33.8,7 C21.2 ; v1(8.51,6.95) 9.03,6.95 9.28,6.7
  Top Layer w0.254: C7.2 v1(9.89,9.68) C8.2 v1(11.62,9.68) L3.1 ; L2.2 43.05,11.21 v1(43.05,9.62) 43.31,9.36 45.47,9.36 v1(45.89,8.94) R3.1 ; R18.2 v1(45.09,1.11) ; R10.1 v1(34.13,16.47) R9.1 v1(36.02,16.47) v1(37.32,16.47) 38.1,16.47 R16.2 ; 22.67,6.7 v1(22.67,7.52) 22.67,8.16 21.98,8.85 21.65,8.85 ; C4.2 v1(13.03,14.89) C5.2 14.16,14.89 v1(14.83,14.22) 15.97,13.08 U2.32 U2.31
  Top Layer w0.508: C13.2 v1(42.99,15.28) v1(42.99,12.82) 42.99,11.27 L2.2
  Bottom Layer w0.254: v1(29,10.76) 29.47,11.23 U7.10 32.09,11.23 32.51,11.65 32.51,12.03 31.91,12.63 U7.12
  vias: v1(18.12,6.7) v1(33.72,7.41)
5V: length 14.6
  Top Layer w0.254: D3.2 57.08,16.15 55.88,14.95 55.88,11.69 ; 55.88,11.69 56.05,11.52 57.26,11.52 ; 55.88,11.69 55.88,7.33 56.51,6.7 57.24,6.7
  Top Layer w0.508: D4.4 57.89,16.73 D3.2
GND: length 82.2
  Top Layer w0.127: SW2.2 50.75,1.04 SW2.4 51.01,0.64 51.29,0.36 54.27,0.36 SW2.3
  Top Layer w0.178: v1(13.46,11.52) 14.67,11.52 14.73,11.46 ; SW1.3 11.46,0.47 8,0.47 7.83,0.64 7.42,0.64 ; v1(35.31,11.14) 35.3,11.15 U5.2 35.3,14.06 35.43,14.19 35.69,14.19 35.8,14.08 U5.1 ; v1(34.93,7.46) 34.3,8.09 U5.7 34.3,10.37 34.29,10.38
  Top Layer w0.254: 7.42,0.64 7.83,1.04 v1(7.83,1.63) SW1.2 ; SW2.4 50.26,0.73 49.02,0.73 48.64,1.11 C25.1 ; C19.1 v1(16.9,1.04) C17.1 ; 20.64,15.22 20.94,15.22 v1(21.34,14.83) 22.16,14.83 C2.2 ; U3.2 50.04,13.17 50.42,13.56 51.44,13.56 53.38,11.61 53.38,9.66 51.82,8.1 R2.1 51.05,7.84 v1(50.64,7.42) 50.16,6.95 45.88,6.95 v1(45.36,7.47) D2.1 ; 57.38,12.44 v1(56.77,13.05) ; 57.59,5.95 56.5,5.95 v1(56.45,6) ; v1(34.29,10.76) 33.53,10.76 32.77,11.52 v1(32.77,12.67) 32.64,12.79 U6.4 ; v1(34.29,10.76) 34.93,10.76 v1(35.31,11.14) ; v1(34.29,10.76) 34.29,10.38 ; C13.1 44.81,15.92 v1(44.81,15.41) C15.1 45.82,14.06 D1.2 ; C7.1 v1(9.89,8.28) C8.1 ; R7.1 38.47,10.13 v1(39.12,9.49) ; Q1.2 23.89,2.27 v1(24,2.38) ; C21.1 35.5,6.89 v1(34.93,7.46) ; C4.1 C5.1 v1(14.95,16.29) C1.1 16.44,16.86 v1(16.76,16.86) 18.47,16.86
  Top Layer w0.508: D1.2 47.42,15.24 v1(48.16,15.98) C14.1 ; v1(56.77,13.05) 56.77,14.32 57.57,15.12 D4.1 ; C23.1 v1(10.54,11.46) ; 26.6,6.7 26.48,6.57 v1(25.48,6.57) 24.32,6.57 C3.1 ; C9.2 v1(14.54,6.7) C10.1
  Bottom Layer w0.508: v1(10.54,11.46) 10.54,11.4
  vias: v1(6.35,16.98) v1(6.35,15.21) v1(6.32,8.98) v1(6.35,3.14) v1(6.35,1.74) v1(8.13,16.98) v1(8.13,15.21) v1(8.13,12.16) v1(9.91,16.98) v1(9.91,15.08) v1(11.94,1.36) v1(13.06,16.28) v1(13.46,8.09) v1(18.03,11.65) v1(18,10.6) v1(18.03,9.62) v1(19.17,11.65) v1(19.17,10.6) v1(19.17,9.62) v1(20.36,11.65) v1(20.4,10.6) v1(20.41,9.62) v1(40.26,16.35) v1(40.26,14.32) v1(40.26,12.16) v1(40.26,8.47) v1(46.26,14.61) v1(49.23,0.73) v1(57.15,2.76) v1(57.15,1.24) v1(58.93,2.76) v1(58.93,1.24) v1(60.58,8.47) v1(60.58,6.57) v1(60.58,2.76) v1(60.58,1.24)
VDDSPI: length 10.6
  Top Layer w0.254: R17.2 C24.2 27.94,6.76 27.94,7.97 26.92,8.98 U6.8 22.86,8.98 22.49,9.35 21.65,9.35
VIN: length 44.9
  Top Layer w0.178: U5.10 35.8,8.09 35.81,8.09 35.94,7.97 38.1,7.97 39.05,7.01 C20.2
  Top Layer w0.254: U5.8 34.8,9.87 35.13,10.2 35.49,10.2 35.8,9.89 U5.10
  Top Layer w0.508: 51.94,16.73 D3.1 55.12,16.29 55.12,9.87 53.38,8.13 53.38,6.61 ; 51.94,16.73 C14.2 50.91,15.11 ; 51.94,16.73 50.99,15.78 U3.4 U3.5 ; 47.64,4.41 45.72,4.41 42.04,8.09 D2.2 39.97,6.7 C20.2
  Top Layer w2.286: CN1.2 51.98,5.17 49.4,5.17 48.64,4.41 47.64,4.41
ANT: length 8.2
  Top Layer w0.254: 11.75,12.92 11.68,12.86 9.91,12.86 arc(6.82,13.54) 4.32,15.46
INA_SCL: length 26.2
  Top Layer w0.178: v1(21.46,6.44) 20.42,7.48 U2.15 ; v1(33.66,11.78) 33.8,11.92 U5.5 33.8,14.44 R10.2
  GND w0.178: 28.45,5.17 29.84,5.17 32.64,7.97 32.64,10.76 v1(33.66,11.78) ; 28.45,5.17 H2.5 ; 28.45,5.17 22.73,5.17 v1(21.46,6.44)
INA_SDA: length 25
  Top Layer w0.127: U2.14 19.92,7.09 20.45,6.57
  Top Layer w0.178: v1(34.54,11.82) 34.54,12.03 34.3,12.28 U5.4 34.3,14.21 R9.2
  GND w0.178: v1(20.61,6.44) 21.25,7.08 21.84,7.08 23.24,5.68 29.46,5.68 32,8.22 32,11.02 33.53,12.54 34.37,12.54 34.54,12.36 34.54,12.03
IO0_NTC: length 28.8
  Top Layer w0.127: v1(16,10.76) 16.09,10.85 16.7,10.85 ; v1(37.34,14.7) 38.09,14.7 R16.1
  Top Layer w0.178: R16.1 R7.2
  GND w0.127: v1(37.34,14.7) 36.07,13.43 17.02,13.43 16,12.41 v1(16,10.76)
IO1_BL: length 20.4
  Top Layer w0.127: v1(22.73,1.36) 23.13,0.97 Q1.1 ; U2.5 16.35,10.35 16.13,10.13 15.75,10.13 v1(15.62,10)
  VCC w0.127: v1(15.62,10) 15.24,10 15.1,9.86 15.1,4.65 13.97,3.52 13.97,1.74 14.48,1.24 15.49,1.24 16,1.74 22.43,1.74 22.73,1.44 v1(22.73,1.36)
IO4_K2: length 48.8
  Top Layer w0.127: 46.64,2 48.84,2 50.37,3.52 53.22,3.52 54.15,2.59 51.27,2.59 ; 46.64,2 46.64,1.21 C25.2 ; 46.64,2 43.18,2 42.68,1.5 R18.1
  Top Layer w0.178: v1(41.78,1.11) R18.1 ; v1(17.02,7.71) 17.02,7.72 U2.9
  GND w0.178: v1(17.02,7.71) 17.02,5.3 18.8,3.52 26.16,3.52 27.05,2.63 27.05,0.98 27.56,0.47 41.15,0.47 v1(41.78,1.11)
IO5_K1: length 12.9
  Top Layer w0.178: U2.10 17.92,7.73 17.78,7.59
  Top Layer w0.254: C17.2 v1(14.96,1.91) 14.04,0.99 R4.1 11.73,2.59 SW1.1
  VCC w0.178: v1(17.91,7.46) 15.88,5.43 15.88,4.54 14.96,3.62 v1(14.96,1.91)
LEDK: length 19.9
  Top Layer w0.254: C19.2 20.01,2.44 R8.2 20.07,2.51 v1(20.96,2.51)
  VCC w0.127: v1(20.96,2.51) 20.96,4.31 25.78,9.14 v1(25.78,12.03)
  Bottom Layer w0.127: U7.11 29.06,11.93 28.57,12.41 26.16,12.41 v1(25.78,12.03)
MOSI: length 19.2
  Top Layer w0.178: 16.7,8.85 15.75,7.9 v1(15.75,7.84)
  Bottom Layer w0.127: v1(15.75,7.84) 15.75,7.33 18.03,5.05 22.48,5.05 24.64,7.2 28.83,7.2 29.71,6.32 U7.3
RESET: length 23.8
  Top Layer w0.127: U2.7 16.37,9.35 16.13,9.11 16.13,8.86 15.88,8.6 15.24,8.6 14.99,8.35 14.99,7.84 14.6,7.46 13.4,7.46 C9.1
  Top Layer w0.178: 10.79,6.7 v1(11.72,6.7) C9.1
  GND w0.178: v1(11.72,6.7) 15.28,3.14 24.51,3.14 25.91,1.74 H2.6
RXD: length 16.5
  Top Layer w0.178: R14.1 26.53,14.96 v1(26.67,14.83)
  VCC w0.178: v1(26.67,14.83) 26.67,5.3 28.45,3.52 29.59,3.52 30.99,2.12 H2.4
SCLK: length 20.1
  Top Layer w0.127: v1(15.62,9.24) 15.75,9.24 16.36,9.85 16.7,9.85
  Bottom Layer w0.127: U7.4 29.7,7.02 29.26,7.46 24.26,7.46 22.1,5.3 18.16,5.3 16.38,7.08 16.38,8.47 v1(15.62,9.24)
SPICLK: length 2.4
  Top Layer w0.178: U6.6 23.86,11.35 21.65,11.35
SPICS: length 13
  Top Layer w0.127: 21.65,10.85 22.06,10.85 22.22,11.02 22.61,11.02 22.77,10.85 26.07,10.85
  Top Layer w0.178: 26.07,10.85 27.94,8.98 U6.1
  Top Layer w0.254: U6.1 32,8.08 R17.1
SPID: length 2.8
  Top Layer w0.178: U6.5 23.11,12.79 22.17,11.85 21.65,11.85
SPIHD: length 2.5
  Top Layer w0.127: 21.65,9.85 22.84,9.85 23.24,10.25 U6.7
SPIQ: length 12.7
  Top Layer w0.178: U6.2 29.97,10.25 29.46,9.75 27.94,9.75 26.54,11.14 26.54,12.79 25.78,13.56 22.85,13.56 21.65,12.35
SPIWP: length 9.9
  Top Layer w0.178: v1(22.35,10.38) 22.32,10.35 21.65,10.35
  Top Layer w0.254: v1(27.43,11.52) U6.3
  GND w0.254: v1(27.43,11.52) 26.29,10.38 v1(22.35,10.38)
TFFT_CS: length 14.7
  Top Layer w0.127: U2.13 19.42,6.83 19.69,6.57
  Bottom Layer w0.178: U7.7 20.97,9.12 19.81,7.97 v1(19.81,6.44)
TFT_DC: length 14.7
  Top Layer w0.127: U2.12 18.92,6.57
  Bottom Layer w0.178: U7.5 23.89,7.72 21.84,5.68 19.56,5.68 18.92,6.32 v1(18.92,6.44)
TFT_RST: length 10.1
  Top Layer w0.178: U2.16 21.37,8.12 v1(21.46,8.22)
  Bottom Layer w0.178: U7.6 21.67,8.42 v1(21.46,8.22)
TXD: length 21.2
  Top Layer w0.178: R13.1 24.76,14.96 v1(24.89,14.83)
  VCC w0.178: v1(24.89,14.83) 25.4,14.83 26.16,15.59 27.18,15.59 27.81,14.95 27.81,14.83 28.19,14.44 28.19,5.43 29.34,4.28 31.37,4.28 33.53,2.12 H2.3
USB_D+: length 44.9
  Top Layer w0.178: R15.1 27.89,16.42 v1(28.45,16.98)
  Top Layer w0.254: USB1.A6 58.42,8.92 58.71,9.21 58.71,9.92 ; 58.71,9.92 59.23,9.92 59.56,10.25 59.56,15.71 60.39,16.54 D4.3 ; 58.71,9.92 USB1.B6 56.59,9.92 v1(56.51,10)
  VCC w0.178: v1(28.45,16.98) 29.97,16.98 33.15,13.81 35.23,13.81 38.28,10.76 51.05,10.76 52.32,9.49 56.01,9.49 v1(56.51,10)
USB_D-: length 42
  Top Layer w0.178: D4.2 60.39,10.19 58.62,8.42 56.58,8.42 56.26,8.73 56.26,9.19 56.5,9.42 57.35,9.42 57.41,9.36 ; R12.1 29.65,16.42 v1(30.35,15.71)
  VCC w0.178: v1(30.35,15.71) 32.77,13.3 35.31,13.3 38.35,10.25 50.67,10.25 52.07,8.86 56.13,8.86 v1(56.51,8.47)
VOUT: length 40.5
  Top Layer w0.178: 37.65,5.43 C20.1 37.65,7.27 37.34,7.59 35.69,7.59 35.3,7.97 U5.9
  Top Layer w2.413: 6.52,6.36 8.22,4.67 ; 8.22,4.67 8.09,4.67 ; 8.22,4.67 40.77,4.67
$1N2271: length 9.3
  Top Layer w0.178: R12.2 28.4,13.83 22.25,13.83 21.49,13.08 U2.25
$1N2275: length 8.6
  Top Layer w0.178: U2.26 20.42,13.4 21.13,14.11 27.45,14.11 27.76,14.42 R15.2
$1N2279: length 8.4
  Top Layer w0.178: R14.2 25.52,16.47 v1(25.15,16.09) ; 20.07,14.19 v1(20.19,14.06) 20.19,13.76 19.92,13.49 U2.27
  GND w0.178: v1(25.15,16.09) 24.59,15.54 21.03,15.54 20.19,14.7 v1(20.19,14.06)
$1N2283: length 7.2
  Top Layer w0.178: v1(19.43,14.06) 19.43,13.09 U2.28 ; v1(23.37,16.09) 23.74,16.47 R13.2
  GND w0.178: 19.43,13.81 v1(19.43,14.06) 19.43,14.44 21.08,16.09 v1(23.37,16.09)
$1N2291: length 6.9
  Top Layer w0.178: C2.1 22.16,16.35 20.77,16.35 X1.3 19.05,15.87 19.05,14.57 18.8,14.32 18.8,13.56 18.92,13.43 U2.29
$1N2297: length 3.9
  Top Layer w0.254: C1.2 17.65,14.89 18.42,14.11 U2.30
$1N3406: length 2.3
  Top Layer w0.254: C16.2 49.09,11.27 U3.1
$1N3430: length 6.2
  Top Layer w0.254: U3.3 51.05,12.27 R2.2 49.77,9.61 R3.2
$1N3499: length 7.9
  Top Layer w0.254: L2.1 45.78,10.38 C16.1 46.8,12.7 D1.1 49.09,14.99 U3.6
$1N4049: length 1.6
  Top Layer w0.254: Q1.3 20.83,0.99 R8.1
$1N6152: length 3.9
  Top Layer w0.254: U2.1 15.88,12.41 15.11,12.67 C22.2 13.72,12.86 L4.2
$1N9079: length 6.7
  Top Layer w0.254: 16.7,11.85 16.2,11.85 16.13,11.78 16.13,11.52 16.3,11.35 ; 16.3,11.35 15.7,11.35 15.49,11.14 15.49,11.08 C6.2 13.85,9.68 L3.2 ; 16.3,11.35 U2.3

## Copper pours and planes (outline as drawn; the poured copper is in the pictures)
3V3 on VCC: 5.21,17.75 61.59,17.75 61.59,0.22 5.21,0.22
GND on Top Layer: 15.37,17.74 61.6,17.74 61.6,0.31 15.37,0.31
GND on Bottom Layer: 5.21,17.87 61.59,17.87 61.59,0.22 5.21,0.22
GND on GND: 5.21,17.75 61.59,17.75 61.59,0.22 5.21,0.22

## Text on the board
Bottom Silkscreen Layer: RST | BOOT | TXD | GND | 3V3 | RXD
